# Altium schematic sheet touch-1ch-sp.SchDoc
size A3
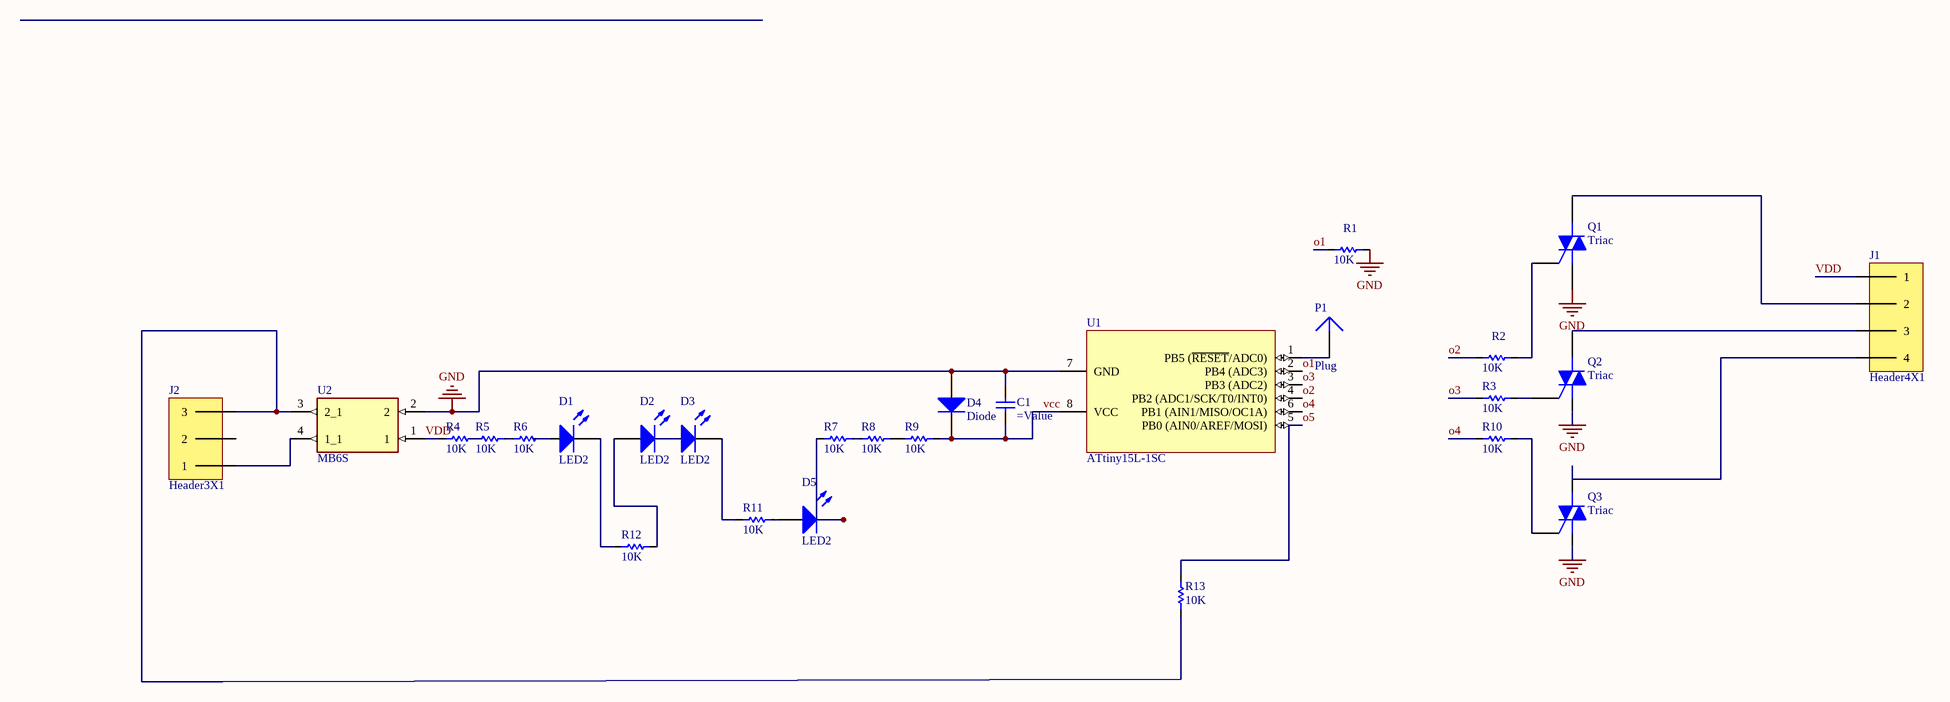
[diagram p0: touch-1ch-sp.SchDoc]

## Parts
C1  (no value)  [CAP 1206]
D1  LED2  [3.2X1.6X1.1]
D2  LED2  [3.2X1.6X1.1]
D3  LED2  [3.2X1.6X1.1]
D4  Diode  [C1206]
D5  LED2  [3.2X1.6X1.1]
J1  Header4X1  [HEADER 4X1]
J2  Header3X1  [HEADER 3X1]
P1  Plug  [PIN1]
Q1  Triac  [SOT89N]
Q2  Triac  [SOT89N]
Q3  Triac  [SOT89N]
R1  10K  [RES 1206 (3216X08L)]
R2  10K  [RES 1206 (3216X08L)]
R3  10K  [RES 1206 (3216X08L)]
R4  10K  [RES 2010 (5026X08L)]
R5  10K  [RES 2010 (5026X08L)]
R6  10K  [RES 2010 (5026X08L)]
R7  10K  [RES 2010 (5026X08L)]
R8  10K  [RES 2010 (5026X08L)]
R9  10K  [RES 2010 (5026X08L)]
R10  10K  [RES 1206 (3216X08L)]
R11  10K  [RES 2010 (5026X08L)]
R12  10K  [RES 2010 (5026X08L)]
R13  10K  [RES 1206 (3216X08L)]
U1  ATtiny15L-1SC  [8S2_N]
U2  MB6S  [SOIC245P670X270-4N]

## Nets
GND: C1.2(-) D4.1(A) Q1.1(M1) Q2.1(M1) Q3.1(M1) R1.2 U1.7(GND) U2.2
o1: R1.1 U1.2(PB4_(ADC3))
o2: R2.1 U1.4(PB2_(ADC1/SCK/T0/INT0))
o3: R3.1 U1.3(PB3_(ADC2))
o4: R10.1 U1.6(PB1_(AIN1/MISO/OC1A))
o5: R13.2 U1.5(PB0_(AIN0/AREF/MOSI))
vcc: C1.1(+) D4.2(K) R9.2 U1.8(VCC)
VDD: J1.1 R4.1 U2.1
NetD1_1: D1.1(A) R6.2
NetD1_2: D1.2(K) R12.1
NetD2_1: D2.1(A) R12.2
NetD2_2: D2.2(K) D3.1(A)
NetD3_2: D3.2(K) R11.1
NetD5_1: D5.1(A) R11.2
NetD5_2: D5.2(K) R7.1
NetJ1_2: J1.2 Q1.2(M2)
NetJ1_3: J1.3 Q2.2(M2)
NetJ1_4: J1.4 Q3.2(M2)
NetJ2_1: J2.1 U2.4(1_1)
NetJ2_3: J2.3 R13.1 U2.3(2_1)
NetP1_1: P1.1 U1.1(PB5_(~{RESET}/ADC0))
NetQ1_3: Q1.3(G) R2.2
NetQ2_3: Q2.3(G) R3.2
NetQ3_3: Q3.3(G) R10.2
NetR4_2: R4.2 R5.1
NetR5_2: R5.2 R6.1
NetR7_2: R7.2 R8.1
NetR8_2: R8.2 R9.1

Not connected (* = marked no-connect by the designer): J2 2

## Library data of the parts
C1 = Capacitor
D1-D3 D5 = LED2: Typical RED, GREEN, YELLOW, AMBER GaAs LED; Published: 8-Jun-2000; LatestRevisionDate: 17-Jul-2002; LatestRevisionNote: Re-released for DXP Platform.; PackageVersion: Feb-2002; PackageReference: 3.2X1.6X1.1; Publisher: Altium Limited; PackageDescription: SM LED; 2 Flat Leads
D4 = Diode: Default Diode; Published: 8-Jun-2000; LatestRevisionDate: 17-Jul-2002; LatestRevisionNote: Re-released for DXP Platform.; PackageVersion: Sep-1996; PackageReference: SMC; Publisher: Altium Limited; PackageDescription: DO-214-AB/SMC; 2 C-Bend Leads; Body 7.9 x 5.9 mm, inc. leads (LxW); Code_JEDEC: DO-214-AB
Q1-Q3 = Triac: Silicon Bidirectional Triode Thyristor; pin to pad: 1>3 3>1; Note: Pin 2 is electrically connected to Pin 4 (TAB); Published: 29-Sep-2000; LatestRevisionDate: 17-Jul-2002; LatestRevisionNote: Re-released for DXP Platform.; DatasheetVersion: 1999; PackageReference: 369-03; Publisher: Altium Limited; PackageDescription: TO, Thru-Hole, Vertical, Heatsink Mounted; 3 In-Line Leads; Pitch 2.28 mm; ComponentLink1Description: Manufacturer Link; ComponentLink1URL: http://www.motorola.com/
R1-R13 = Resistor: Tolerance: 5%; Power: 1/4 W; Value: 10K
U1 = ATtiny15L-1SC: 8-Bit AVR Microcontroller with 1K Byte of Flash Memory; Published: 17-Sep-2003; LatestRevisionDate: 16-Oct-2006; LatestRevisionNote: IPC-7351 Footprint Added.; DatasheetVersion: 1187E-AVR-06/02; PackageVersion: revF, Apr-2008; PackageReference: 8S2; Publisher: Altium Limited; PackageDescription: 8-Lead, 0.208" Body, Plastic Small Outline Package (EIAJ); Supplier 1: Digi-Key; Supplier Part Number 1: ATTINY15L-1SC-ND; Supplier 2: Mouser; Supplier Part Number 2: 556-ATTINY15L1SC; ComponentLink1Description: Datasheet; ComponentLink1URL: http://www.atmel.com/dyn/resources/prod_documents/doc1187.pdf; ComponentLink2Description: Atmel.com Home; ComponentLink2URL: http://www.atmel.com
U2 = MB6S: Bridge Rectifier Single Phase Standard 600V Surface Mount 4-SOIC; MF: ON Semiconductor; Digi-Key_Purchase_URL: https://www.digikey.com.tr/product-detail/en/on-semiconductor/MB6S/MB6SCT-ND/965654?utm_source=snapeda&utm_medium=aggregator&utm_campaign=symbol; Value: *; Package: BESOP-4 Surge Components; Digi-Key_Part_Number: MB6SCT-ND; SnapEDA_Link: https://www.snapeda.com/parts/MB6S/ON%20Semiconductor/view-part/2774209/?ref=snap; MP: MB6S
P1 = Plug: LatestRevisionDate: 17-Jul-2002; LatestRevisionNote: Re-released for DXP Platform.; Publisher: Altium Limited